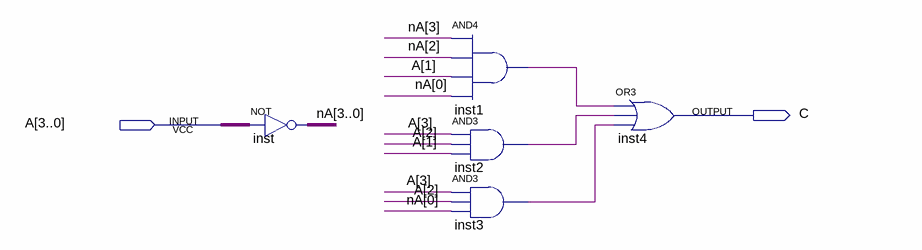
[diagram p0: schematic sheet]
// Quartus schematic C.bdf as structural Verilog: 5 symbols, 2 pins
module C (
  input  [3:0] A,
  output C
);

  wire inst1_out, inst2_out, inst3_out;
  wire [3:0] nA;

  assign nA = ~A;  // NOT inst, 4 bits wide
  and inst1 (inst1_out, nA[3], nA[2], A[1], nA[0]);
  and inst2 (inst2_out, A[3], A[2], A[1]);
  and inst3 (inst3_out, A[3], A[2], nA[0]);
  or inst4 (C, inst1_out, inst2_out, inst3_out);
endmodule
